# EAGLE schematic SparkFun_Dev_ESP32_C3_MINI - PTH (EAGLE 9.6.2)
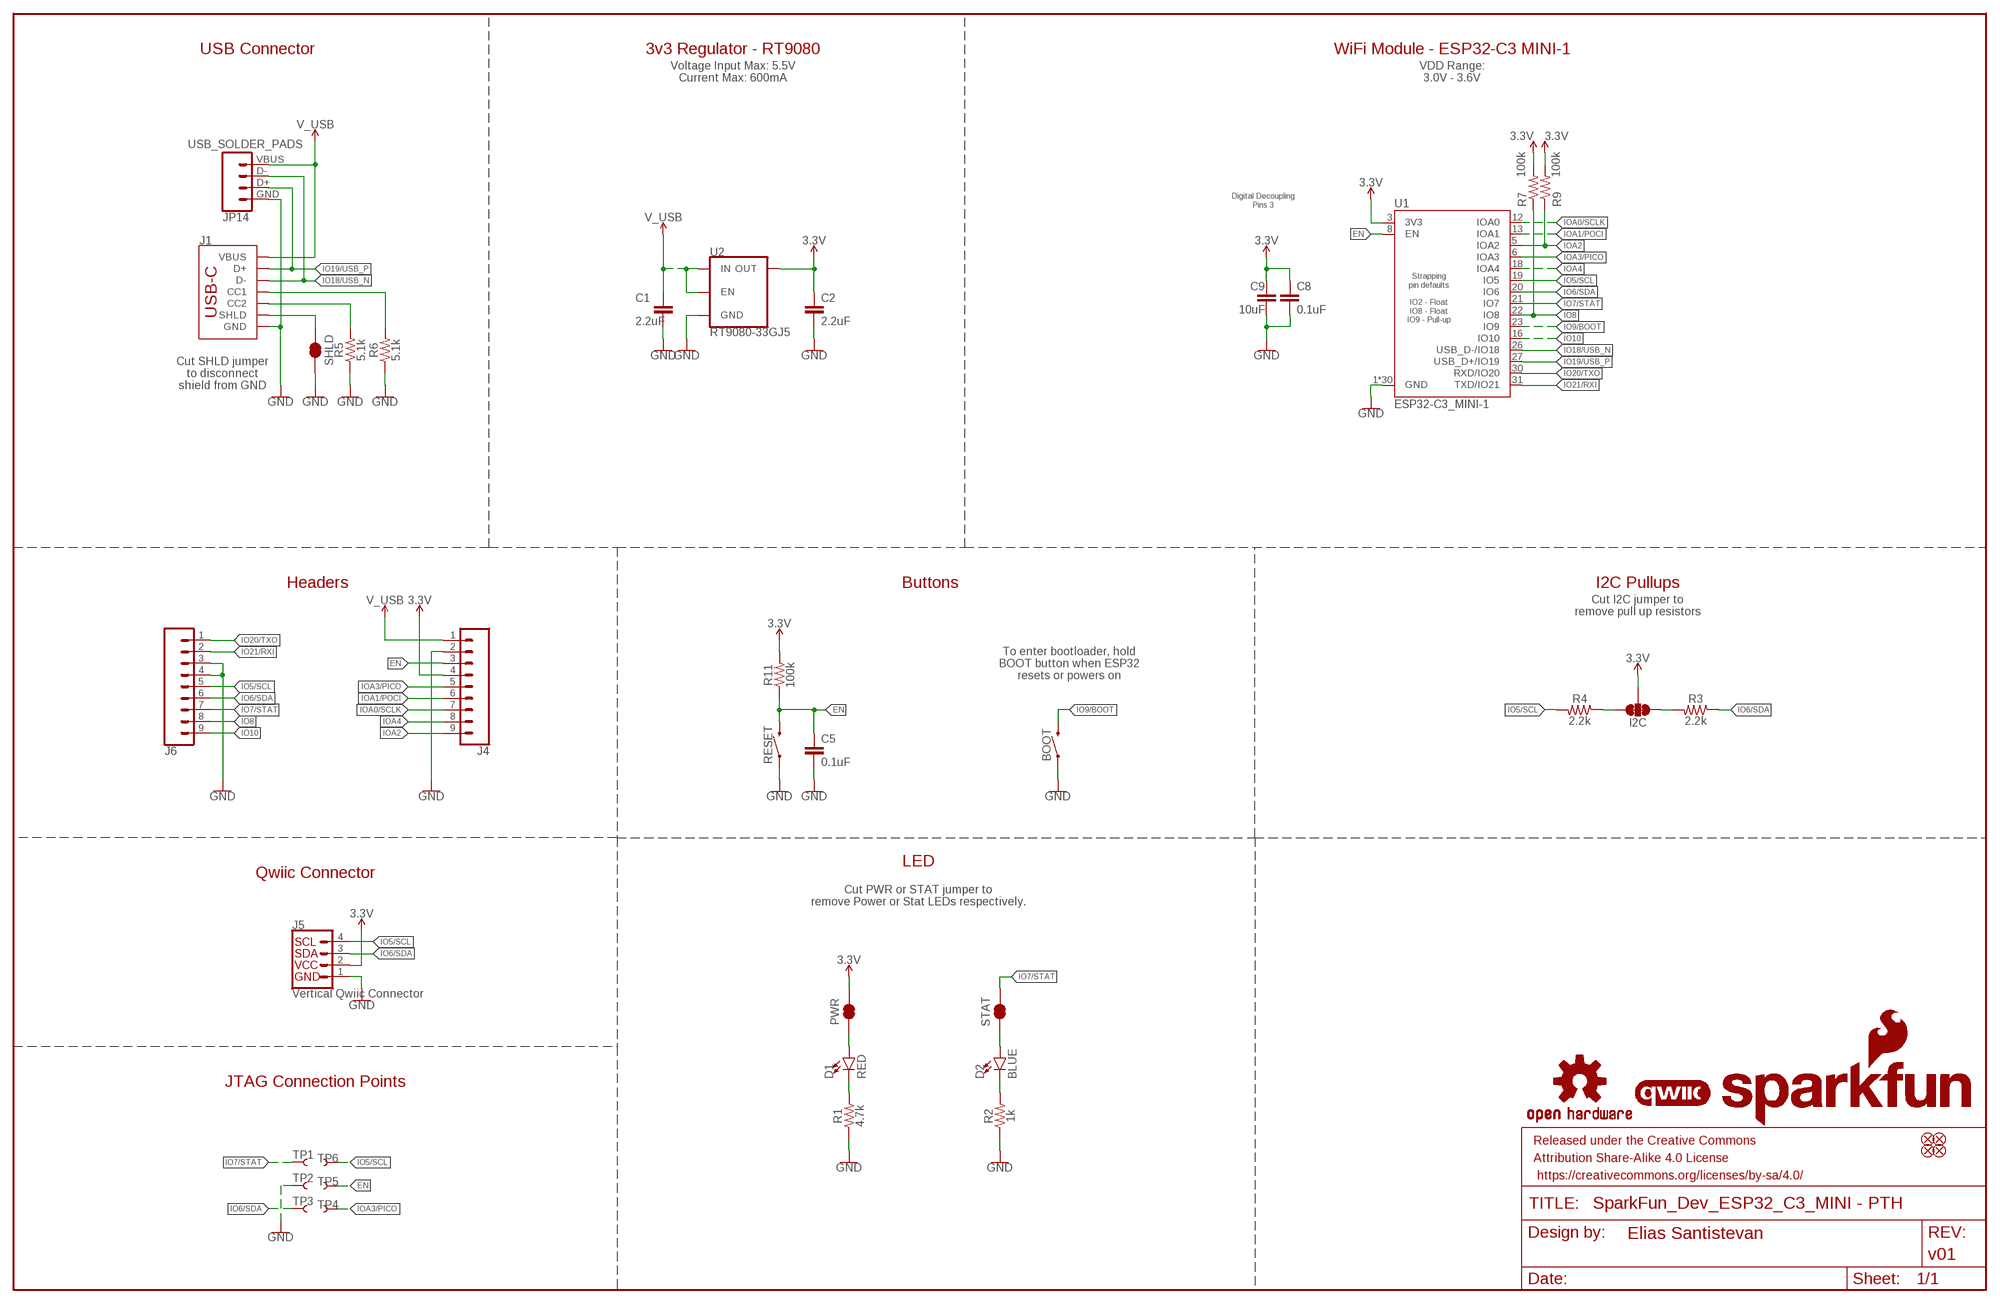
[diagram p0: schematic, sheet 1]

## Parts
BOOT  MOMENTARY-SWITCH-SPST-SMD-4.6X2.8MM  [TACTILE_SWITCH_SMD_4.6X2.8MM]
C1  2.2uF  2.2UF-0402_TIGHT-10V-10%-X5R  [0402-TIGHT]
C2  2.2uF  2.2UF-0402_TIGHT-10V-10%-X5R  [0402-TIGHT]
C5  0.1uF  0.1UF-0402T-6.3V-10%-X7R  [0402-TIGHT]
C8  0.1uF  0.1UF-0402T-16V-10%  [0402-TIGHT]
C9  10uF  10UF-0402T-6.3V-20%  [0402-TIGHT]
D1  RED  LED-RED_0603-KB  [LED-0603]
D2  BLUE  LED-BLUE0603  [LED-0603]
FD1  FIDUCIALUFIDUCIAL  [FIDUCIAL-MICRO]
FD2  FIDUCIALUFIDUCIAL  [FIDUCIAL-MICRO]
FD3  FIDUCIALUFIDUCIAL  [FIDUCIAL-MICRO]
FD4  FIDUCIALUFIDUCIAL  [FIDUCIAL-MICRO]
FRAME2  FRAME-LEDGER  [CREATIVE_COMMONS]
I2C  JUMPER-SMT_3_2-NC_TRACE_SILK  [SMT-JUMPER_3_2-NC_TRACE_SILK]
J1  USB Female Type C Connector  USB_C_4-LAYER_PADS  [USB-C-16P_4LAYER-PADS]
J4  CONN_09NO_SILK  [1X09_NO_SILK]
J5  Vertical Qwiic Connector  QWIIC_CONNECTOR  [JST04_1MM_VERT]
J6  CONN_09NO_SILK  [1X09_NO_SILK]
JP14  USB_SOLDER_PADS  [USB-SOLDER-PADS]
LOGO1  SFE_LOGO_NAME_FLAMEBLANK  [BLANK]
LOGO2  QWIIC_LOGO_3MM  [QWIIC_3MM]
LOGO3  OSHW-LOGOS  [OSHW-LOGO-S]
PWR  JUMPER-SMT_2_NC_TRACE_SILK  [SMT-JUMPER_2_NC_TRACE_SILK]
R1  4.7k  4.7KOHM-0402T-1/16W-1%  [0402-TIGHT]
R2  1k  1KOHM-0402T-1/16W-1%  [0402-TIGHT]
R3  2.2k  2.2KOHM-0402T-1/16W-1%  [0402-TIGHT]
R4  2.2k  2.2KOHM-0402T-1/16W-1%  [0402-TIGHT]
R5  5.1k  5.1KOHM-0402T-1/16W-1%  [0402-TIGHT]
R6  5.1k  5.1KOHM-0402T-1/16W-1%  [0402-TIGHT]
R7  100k  100KOHM-0402T-1/16W-1%  [0402-TIGHT]
R9  100k  100KOHM-0402T-1/16W-1%  [0402-TIGHT]
R11  100k  100KOHM-0402T-1/16W-1%  [0402-TIGHT]
RESET  MOMENTARY-SWITCH-SPST-SMD-4.6X2.8MM  [TACTILE_SWITCH_SMD_4.6X2.8MM]
SHLD  JUMPER-SMT_2_NC_TRACE_SILK  [SMT-JUMPER_2_NC_TRACE_SILK]
STAT  JUMPER-SMT_2_NC_TRACE_SILK  [SMT-JUMPER_2_NC_TRACE_SILK]
TP1  TEST-POINT3X5  [PAD.03X.05]
TP2  TEST-POINT3X5  [PAD.03X.05]
TP3  TEST-POINT3X5  [PAD.03X.05]
TP4  TEST-POINT3X5  [PAD.03X.05]
TP5  TEST-POINT3X5  [PAD.03X.05]
TP6  TEST-POINT3X5  [PAD.03X.05]
U1  ESP32-C3_MINI-1  [ESP32-C3-MINI-1]
U2  RT9080-33GJ5  V_REG_RT9080  [SOT23-5]

## Nets
3.3V: C2.1 C8.1 C9.1 I2C.2 J4.4 J5.2 PWR.2 R7.2 R9.2 R11.2 U1.3(3V3) U2.5(OUT)
EN: C5.1 J4.3 R11.1 RESET.3 RESET.4 TP5.1 U1.8(EN)
GND: BOOT.1 BOOT.2 C1.2 C2.2 C5.2 C8.2 C9.2 J1.GND J1.GND2(GND) J4.2 J5.1 J6.3 J6.4 JP14.GND R1.1 R2.1 R5.1 R6.1 RESET.1 RESET.2 SHLD.2 TP2.1 U1.1(GND) U1.2(GND) U1.11(GND) U1.14(GND) U1.36(GND) U1.37(GND) U1.38(GND) U1.39(GND) U1.40(GND) U1.41(GND) U1.42(GND) U1.43(GND) U1.44(GND) U1.45(GND) U1.46(GND) U1.47(GND) U1.48(GND) U1.49.1(GND) U1.49.2(GND) U1.49.3(GND) U1.49.4(GND) U1.49.5(GND) U1.49.6(GND) U1.49.7(GND) U1.49.8(GND) U1.49.9(GND) U1.50(GND) U1.51(GND) U1.52(GND) U1.53(GND) U2.2(GND)
IO5/SCL: J5.4 J6.5 R4.2 TP6.1 U1.19(IO5)
IO6/SDA: J5.3 J6.6 R3.1 TP3.1 U1.20(IO6)
IO7/STAT: J6.7 STAT.2 TP1.1 U1.21(IO7)
IO8: J6.8 R7.1 U1.22(IO8)
IO9/BOOT: BOOT.3 BOOT.4 U1.23(IO9)
IO10: J6.9 U1.16(IO10)
IO18/USB_N: J1.A7(D-) J1.B7(D-) JP14.D- U1.26(USB_D-/IO18)
IO19/USB_P: J1.A6(D+) J1.B6(D+) JP14.D+ U1.27(USB_D+/IO19)
IO20/TXO: J6.1 U1.30(RXD/IO20)
IO21/RXI: J6.2 U1.31(TXD/IO21)
IOA0/SCLK: J4.7 U1.12(IOA0)
IOA1/POCI: J4.6 U1.13(IOA1)
IOA2: J4.9 R9.1 U1.5(IOA2)
IOA3/PICO: J4.5 TP4.1 U1.6(IOA3)
IOA4: J4.8 U1.18(IOA4)
N$1: D1.C R1.2
N$2: D1.A PWR.1
N$3: D2.C R2.2
N$4: I2C.3 R3.2
N$5: I2C.1 R4.1
N$7: J1.B5(CC2) R5.2
N$8: J1.A5(CC1) R6.2
N$11: D2.A STAT.1
SHLD: J1.SHLD1(SHLD) J1.SHLD2(SHLD) J1.SHLD3(SHLD) J1.SHLD4(SHLD) SHLD.1
V_USB: C1.1 J1.VBUS1(VBUS) J1.VBUS2(VBUS) J4.1 JP14.VBUS U2.1(IN) U2.3(EN)

## Notes on the sheet
- USB Connector | 3v3 Regulator - RT9080 | WiFi Module - ESP32-C3 MINI-1
- Voltage Input Max: 5.5V
  Current Max: 600mA
- VDD Range:
  3.0V - 3.6V
- Digital Decoupling
  Pins 3
- Cut SHLD jumper
  to disconnect
  shield from GND
- Headers | Buttons | I2C Pullups
- Cut I2C jumper to
  remove pull up resistors
- To enter bootloader, hold
  BOOT button when ESP32
  resets or powers on
- LED
- Qwiic Connector
- Cut PWR or STAT jumper to
  remove Power or Stat LEDs respectively.
- JTAG Connection Points

## Library data of the parts
BOOT RESET = SparkFun-Switches:MOMENTARY-SWITCH-SPST: Momentary Switch (Pushbutton) - SPST Normally-open (NO) SPST momentary switches (buttons, pushbuttons). Variants PTH-12MM - 12mm square, through-hole Momentary Pushbutton Switch - 12mm Square <https://www.sparkfun.com/products/9190> (COM-09190) PTH-6.0MM, PTH-6.0MM-KIT - 6.0mm square, through-hole Mini Pushbutton Switch <https://www.sparkfun.com/products/97> (COM-00097) KIT package intended for soldering kit's - only one side of pads' copper is exposed. PTH-RIGHT-ANGLE-KIT - Right-angle, through-hole Right Angle Tactile Button <https://www.sparkfun.com/products/10791> - Used on SparkFun BigTime Watch Kit <https://www.sparkfun.com/products/11734> SMD-12MM - 12mm square, surface-mount Tactile Button - SMD (12mm) <https://www.sparkfun.com/products/12993> (COM-12993) Used on SparkFun PicoBoard <https://www.sparkfun.com/products/11888> SMD-4.5MM - 4.5mm Square Trackball Switch Used on SparkFun Blackberry Trackballer Breakout <https://www.sparkfun.com/products/13169> SMD-4.6MMX2.8MM - 4.60mm x 2.80mm, surface mount Used on SparkFun Pro Micro - RP2040 <https://www.sparkfun.com/products/17717> SMD-5.2MM, SMD-5.2-REDUNDANT - 5.2mm square, surface-mount Mini Pushbutton Switch - SMD <https://www.sparkfun.com/products/8720> (COM-08720) Used on Arduino Pro Mini <https://www.sparkfun.com/products/11114> REDUNDANT package connects both switch circuits together SMD-6.0X3.5MM - 6.0 x 3.5mm, surface mount Momentary Reset Switch SMD <https://www.sparkfun.com/products/8229> (COM-08229) SMD-6.2MM-TALL - 6.2mm square, surface mount Tactile Button - SMD (6mm) <https://www.sparkfun.com/products/12992> Used on SparkFun Digital Sandbox <https://www.sparkfun.com/products/12651> SMD-RIGHT-ANGLE - Right-angle, surface mount Used on SparkFun Block for Intel® Edison - Arduino <https://www.sparkfun.com/products/13036>; PROD_ID: SWCH-15606
C1 C2 = SparkFun-Capacitors:2.2UF: 2.2µF ceramic capacitors A capacitor is a passive two-terminal electrical component used to store electrical energy temporarily in an electric field.; PROD_ID: CAP-14232
C5 = SparkFun-Capacitors:0.1UF: 0.1µF ceramic capacitors A capacitor is a passive two-terminal electrical component used to store electrical energy temporarily in an electric field.; PROD_ID: CAP-14993
C8 = SparkFun-Capacitors:0.1UF: 0.1µF ceramic capacitors A capacitor is a passive two-terminal electrical component used to store electrical energy temporarily in an electric field.; PROD_ID: CAP-12416
C9 = SparkFun-Capacitors:10UF: 10.0µF ceramic capacitors A capacitor is a passive two-terminal electrical component used to store electrical energy temporarily in an electric field.; PROD_ID: CAP-14848
D1 = SparkFun-LED:LED-RED: Red SMD LED Used in manufacturing of most products at SparkFun Packages: 0603 - KB - KingBright (DIO-17976) SMD 0603 package [Datasheet] <https://www.kingbrightusa.com/images/catalog/SPEC/APT1608SURCK.pdf> 0603 - (DIO-00819, has gone EOL) SMD 0603 package 0603 SMART - SMD 0603 SMART package ( more efficient and expensive)[Product Link] <http://www.osram-os.com/Graphics/XPic2/00077099_0.pdf> 1206 - SMD1206 package [Product Link] <https://www.sparkfun.com/datasheets/DevTools/LilyPad/Q150OVS4.pdff> SparkFun Products: Pro Mini 328 -5V <https://www.sparkfun.com/products/821> RedBoard <https://www.sparkfun.com/products/12757> IOIO-OTG <https://www.sparkfun.com/products/13613>; PROD_ID: DIO-17976
D2 = SparkFun-LED:LED-BLUE: Blue SMD LED Used in manufacturing of various products at SparkFun Packages: 0603 - SMD 0603 package [Product Link] <http://www.digikey.com/product-detail/en/SMLE12BC7TT86/511-1589-2-ND/1641808> 1206 - SMD1206 package [Product Link] <http://www.digikey.com/product-detail/en/lite-on-inc/LTST-C150TBKT/160-1643-1-ND/573584> SparkFun Products: ESP8266 Thing-Dev Board <https://www.sparkfun.com/products/13711> RedBoard <https://www.sparkfun.com/products/12757>; PROD_ID: DIO-08575
FD1-FD4 = SparkFun-Aesthetics:FIDUCIAL: Fiducial Alignment Points Point-of-reference for pick-and-place machines and other optical instruments.
FRAME2 = SparkFun-Aesthetics:FRAME-LEDGER: Schematic Frame - Ledger Standard 11x14 US Ledger frame; DESIGNER: Elias Santistevan; REV: v01
I2C = SparkFun-Jumpers:JUMPER-SMT_3_2-NC_TRACE: Normally closed trace jumper (2 of 2 connections) This jumper has a trace between all three pads so they are normally closed (NC). Use a razor knife to open the connection(s). For best results follow the IPC guidelines for cutting traces: Cutout at least 0.063 mm (0.005 in). Remove all loose material to clean up the cut area. Seal the cut with an approved epoxy. Reapply solder to reclose the connection(s).
J1 = SparkFun-Connectors:USB_C: USB Type C 16Pin Connector Super Speed pins not available on the 16-pin purely SMD connector so this part is best for USB 2.0 implementations. D1 and D2 are tied together enabling D+/- no matter which way the cable is plugged into the connector. The two channel configuration pins (CC1/2) are exposed. These are normally connected to ground via 5.1k resistors but can be reconfigured for high current/high power applications. **4-LAYER BOARD WARNING!!** If designing 4-layer board, make sure to select the variant _4-LAYER-ISOLATED. The linked footprint (USB-C-16-4LAYER-ISOLATED) includes some very necessary cutout polygons in the inner layers (2 and 15). This prevents the PTH mounting shield legs on the USB connector from electrically connecting any other polygons on the inner layers (usually VCC and GND).; PROD_ID: CONN-14122
J4 J6 = SparkFun-Connectors:CONN_09: Multi connection point. Often used as Generic Header-pin footprint for 0.1 inch spaced/style header connections On any of the 0.1 inch spaced packages, you can populate with these: Break Away Headers - Straight <https://www.sparkfun.com/products/116> (PRT-00116) Break Away Male Headers - Right Angle <https://www.sparkfun.com/products/553> (PRT-00553) Female Headers <https://www.sparkfun.com/products/115> (PRT-00115) Break Away Headers - Machine Pin <https://www.sparkfun.com/products/117> (PRT-00117) Break Away Female Headers - Swiss Machine Pin <https://www.sparkfun.com/products/743> (PRT-00743) For SCREWTERMINALS and SPRING TERMINALS visit here: Screw Terimnals on SparkFun.com <https://www.sparkfun.com/search/results?term=Screw+Terminals> (5mm/3.5mm/2.54mm spacing) This device is also useful as a general connection point to wire up your design to another part of your project. Our various solder wires solder well into these plated through hole pads. Hook-Up Wire - Assortment (Stranded, 22 AWG) <https://www.sparkfun.com/products/11375> (PRT-11375) Hook-Up Wire - Assortment (Solid Core, 22 AWG) <https://www.sparkfun.com/products/11367> (PRT-11367) View the entire wire category on our website here <https://www.sparkfun.com/categories/141> Special notes: Molex polarized connector foot print use with SKU : PRT-08231 with associated crimp pins and housings. 1MM SMD Version SKU: PRT-10208 NOTES ON THE VARIANTS LOCK and LOCK_LONGPADS... This footprint was designed to help hold the alignment of a through-hole component (i.e. 6-pin header) while soldering it into place. You may notice that each hole has been shifted either up or down by 0.005 of an inch from it's more standard position (which is a perfectly straight line). This slight alteration caused the pins (the squares in the middle) to touch the edges of the holes. Because they are alternating, it causes a "brace" to hold the component in place. 0.005 has proven to be the perfect amount of "off-center" position when using our standard breakaway headers. Although looks a little odd when you look at the bare footprint, once you have a header in there, the alteration is very hard to notice. Also,if you push a header all the way into place, it is covered up entirely on the bottom side.
J5 = SparkFun-Connectors:QWIIC_CONNECTOR: SparkFun I2C Standard Qwiic Connector An SMD 1mm pitch JST connector makes it easy and quick (get it? Qwiic?) to connect I2C devices to each other. The Qwiic system <http://www.sparkfun.com/qwiic> enables fast and solderless connection between popular platforms and various sensors and actuators. We carry 200mm <https://www.sparkfun.com/products/14204>, 100mm <https://www.sparkfun.com/products/14205>, 50mm <https://www.sparkfun.com/products/14206>, and breadboard friendly <https://www.sparkfun.com/products/14207> Qwiic cables. We also offer 10 pcs strips <https://www.sparkfun.com/products/14323> the SMD connectors.; PROD_ID: CONN-14483
JP14 = SparkFun-Connectors:USB_SOLDER_PADS: Solder pad access to USB pins. Helpful to expose on PCBs so user can attach external USB connector if necessary.
LOGO1 = SparkFun-Aesthetics:SFE_LOGO_NAME_FLAME: SparkFun Font Logo w/ Flame This is the SparkFun full logo. The logo on the schematic will always be the same size; the package variant is the height of the flame part of the logo. Default layer for the logo on the board is tSilk.
LOGO2 = SparkFun-Aesthetics:QWIIC_LOGO: Qwiic Logos for placement on schematic and PCB. The 5.5mm silk logo is best for placing next to Qwiic connector.
LOGO3 = SparkFun-Aesthetics:OSHW-LOGO: Open-Source Hardware (OSHW) Logo This logo indicates the piece of hardware it is found on incorporates a OSHW license and/or adheres to the definition of open source hardware found here: http://freedomdefined.org/OSHW
PWR SHLD STAT = SparkFun-Jumpers:JUMPER-SMT_2_NC_TRACE: Normally closed trace jumper This jumper has a trace between two pads so it's normally closed (NC). Use a razor knife to open the connection. For best results follow the IPC guidelines for cutting traces: Cutout at least 0.063 mm (0.005 in). Remove all loose material to clean up the cut area. Seal the cut with an approved epoxy. Reapply solder to reclose the connection.
R1 = SparkFun-Resistors:4.7KOHM: 4.7kΩ resistor A resistor is a passive two-terminal electrical component that implements electrical resistance as a circuit element. Resistors act to reduce current flow, and, at the same time, act to lower voltage levels within circuits. - Wikipedia; PROD_ID: RES-15343
R2 = SparkFun-Resistors:1KOHM: 1kΩ resistor A resistor is a passive two-terminal electrical component that implements electrical resistance as a circuit element. Resistors act to reduce current flow, and, at the same time, act to lower voltage levels within circuits. - Wikipedia; PROD_ID: RES-14342
R3 R4 = SparkFun-Resistors:2.2KOHM: 2.2kΩ resistor A resistor is a passive two-terminal electrical component that implements electrical resistance as a circuit element. Resistors act to reduce current flow, and, at the same time, act to lower voltage levels within circuits. - Wikipedia; PROD_ID: RES-14341
R5 R6 = SparkFun-Resistors:5.1KOHM; PROD_ID: RES-14340
R7 R9 R11 = SparkFun-Resistors:100KOHM: 100kΩ resistor A resistor is a passive two-terminal electrical component that implements electrical resistance as a circuit element. Resistors act to reduce current flow, and, at the same time, act to lower voltage levels within circuits. - Wikipedia; PROD_ID: RES-13495
TP1-TP6 = SparkFun-Connectors:TEST-POINT: SparkFun Test Points Bare copper test points for troubleshooting or In-Circuit-Testing. These are used by our Production team for verifying production board runs using pogo-pins on test beds. SparkFun Products: SparkFun LSM9DS1 Breakout <https://www.sparkfun.com/products/13284> SparkFun PSOC <https://www.sparkfun.com/products/13714> SparkFun Load Cell Amplifier <https://www.sparkfun.com/products/13879>
U1 = ESP32-C3-MINI-1:ESP32-C3_MINI-1: Espressif ESP32C3-MINI-1 ESP32-C3-MINI-1 and ESP32-C3-MINI-1U are two general-purpose Wi-Fi and Bluetooth LE modules. The rich set of peripherals and a small size make the two modules an ideal choice for smart homes, industrial automation, health care, consumer electronics, etc. ESP32-C3-MINI-1 comes with a PCB antenna. ESP32-C3-MINI-1U comes with an external antenna connector. A wide selection of module variants are available as shown in Table 1 and 2. The series comparison for the two modules is as follows:
U2 = SparkFun-IC-Power:V_REG_RT9080; PROD_ID: VREG-19034

## Net classes
1 Power: width 0.127 mm, clearance 0.178 mm